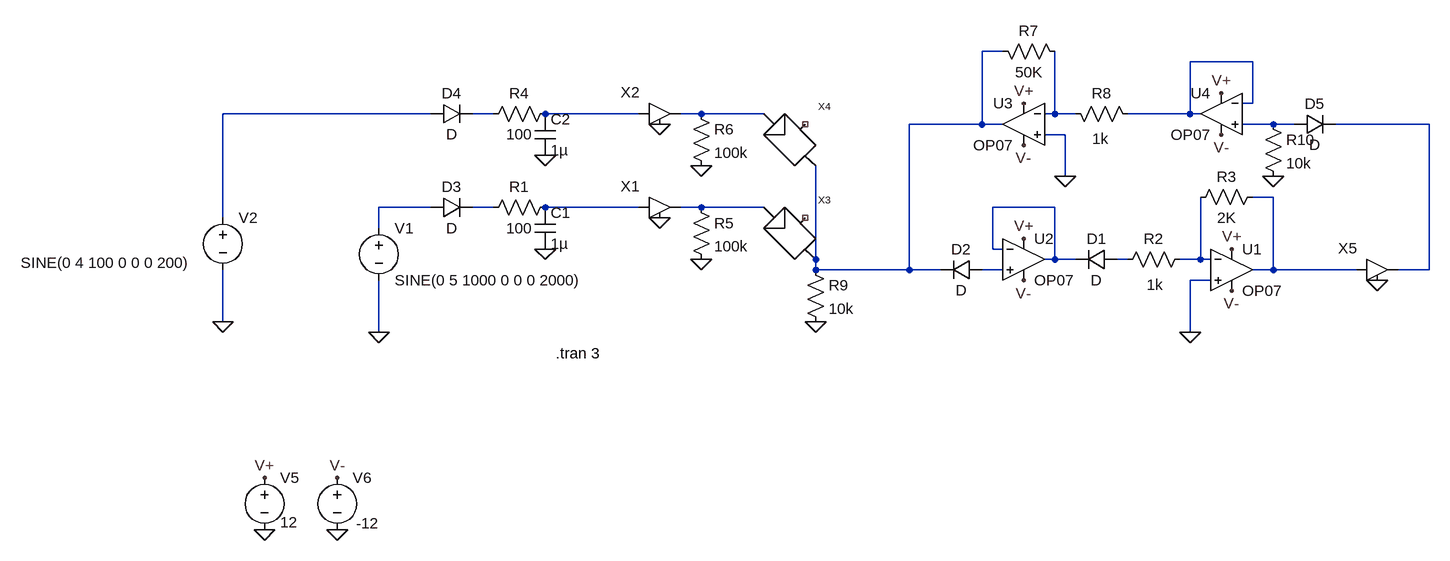
[diagram p0: schematic Net Trial.asc]
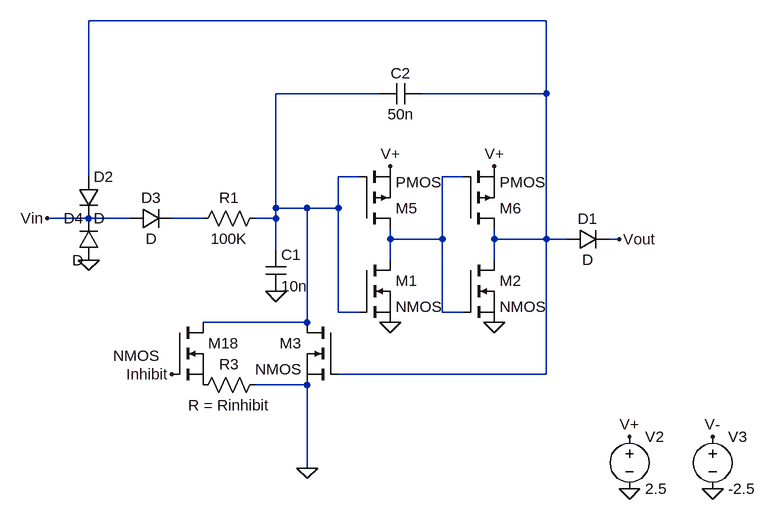
[diagram p1: sub-circuit axon-hillock.asc]
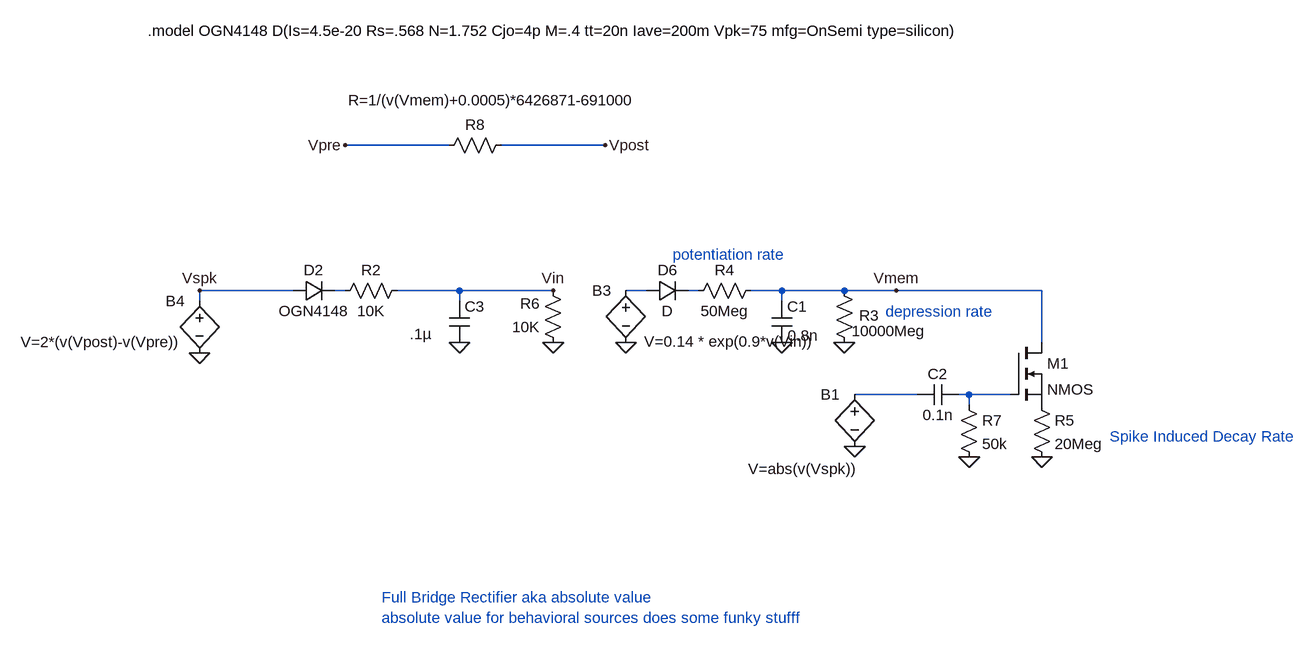
[diagram p2: sub-circuit synapse.asc]
Net Trial.asc, the LTspice schematic file:
Version 4
SHEET 1 1284 804
WIRE 624 -64 592 -64
WIRE 1008 -48 912 -48
WIRE 1008 16 1008 -48
WIRE 1008 16 992 16
WIRE -256 32 -576 32
WIRE -160 32 -192 32
WIRE 64 32 -80 32
WIRE 160 32 128 32
WIRE 256 32 160 32
WIRE 704 32 704 -64
WIRE 704 32 688 32
WIRE 736 32 704 32
WIRE 912 32 912 -48
WIRE 912 32 816 32
WIRE 928 32 912 32
WIRE 592 48 592 -64
WIRE 592 48 480 48
WIRE 624 48 592 48
WIRE 1040 48 992 48
WIRE 1072 48 1040 48
WIRE 1280 48 1136 48
WIRE 720 64 688 64
WIRE 720 128 720 64
WIRE 1040 160 1008 160
WIRE -256 176 -336 176
WIRE -160 176 -192 176
WIRE 64 176 -80 176
WIRE 160 176 128 176
WIRE 256 176 160 176
WIRE 704 176 608 176
WIRE -576 192 -576 32
WIRE -336 208 -336 176
WIRE 608 240 608 176
WIRE 624 240 608 240
WIRE 336 256 336 112
WIRE 704 256 704 176
WIRE 704 256 688 256
WIRE 736 256 704 256
WIRE 816 256 800 256
WIRE 928 256 928 160
WIRE 928 256 896 256
WIRE 944 256 928 256
WIRE 336 272 336 256
WIRE 480 272 480 48
WIRE 480 272 336 272
WIRE 528 272 480 272
WIRE 624 272 592 272
WIRE 1040 272 1040 160
WIRE 1040 272 1008 272
WIRE 1168 272 1040 272
WIRE 1280 272 1280 48
WIRE 1280 272 1232 272
WIRE 944 288 912 288
WIRE -576 352 -576 272
WIRE -336 368 -336 288
WIRE 912 368 912 288
FLAG -336 368 0
FLAG 96 192 0
FLAG -576 352 0
FLAG 1200 288 0
FLAG 96 48 0
FLAG -512 672 0
FLAG -400 672 0
FLAG -512 592 V+
FLAG -400 592 V-
FLAG -80 240 0
FLAG -80 96 0
FLAG 912 368 0
FLAG 976 240 V+
FLAG 976 304 V-
FLAG 160 112 0
FLAG 160 256 0
FLAG 656 224 V+
FLAG 656 288 V-
FLAG 720 128 0
FLAG 656 16 V+
FLAG 656 80 V-
FLAG 960 0 V+
FLAG 960 64 V-
FLAG 1040 128 0
FLAG 336 352 0
SYMBOL voltage -336 192 R0
WINDOW 123 0 0 Left 2
WINDOW 39 0 0 Left 2
SYMATTR InstName V1
SYMATTR Value SINE(0 5 1000 0 0 0 2000)
SYMBOL Axon-Hillock 80 176 R0
SYMATTR InstName X1
SYMATTR SpiceLine Rinhibit = 1Mg
SYMBOL Axon-Hillock 80 32 R0
SYMATTR InstName X2
SYMATTR SpiceLine Rinhibit = 10Meg
SYMBOL voltage -576 176 R0
WINDOW 123 0 0 Left 2
WINDOW 39 0 0 Left 2
WINDOW 3 -311 85 Left 2
SYMATTR Value SINE(0 4 100 0 0 0 200)
SYMATTR InstName V2
SYMBOL Synapse 256 176 R0
SYMATTR InstName X3
SYMBOL Synapse 256 32 R0
SYMATTR InstName X4
SYMBOL voltage -512 576 R0
WINDOW 123 0 0 Left 2
WINDOW 39 0 0 Left 2
WINDOW 3 24 84 Left 2
SYMATTR Value 12
SYMATTR InstName V5
SYMBOL voltage -400 576 R0
WINDOW 123 0 0 Left 2
WINDOW 39 0 0 Left 2
WINDOW 3 29 86 Left 2
SYMATTR Value -12
SYMATTR InstName V6
SYMBOL cap -96 176 R0
SYMATTR InstName C1
SYMATTR Value 1µ
SYMBOL res -64 160 R90
WINDOW 0 0 56 VBottom 2
WINDOW 3 32 56 VTop 2
SYMATTR InstName R1
SYMATTR Value 100
SYMBOL diode -256 192 R270
WINDOW 0 32 32 VTop 2
WINDOW 3 0 32 VBottom 2
SYMATTR InstName D3
SYMBOL cap -96 32 R0
SYMATTR InstName C2
SYMATTR Value 1µ
SYMBOL res -64 16 R90
WINDOW 0 0 56 VBottom 2
WINDOW 3 32 56 VTop 2
SYMATTR InstName R4
SYMATTR Value 100
SYMBOL diode -256 48 R270
WINDOW 0 32 32 VTop 2
WINDOW 3 0 32 VBottom 2
SYMATTR InstName D4
SYMBOL Opamps\\OP07 976 208 R0
SYMATTR InstName U1
SYMBOL res 1024 144 R90
WINDOW 0 0 56 VBottom 2
WINDOW 3 32 56 VTop 2
SYMATTR InstName R3
SYMATTR Value 2K
SYMBOL res 144 160 R0
SYMATTR InstName R5
SYMATTR Value 100k
SYMBOL res 144 16 R0
SYMATTR InstName R6
SYMATTR Value 100k
SYMBOL res 912 240 R90
WINDOW 0 0 56 VBottom 2
WINDOW 3 39 54 VTop 2
SYMATTR InstName R2
SYMATTR Value 1k
SYMBOL Opamps\\OP07 656 192 R0
SYMATTR InstName U2
SYMBOL diode 800 240 R90
WINDOW 0 0 32 VBottom 2
WINDOW 3 32 32 VTop 2
SYMATTR InstName D1
SYMBOL diode 592 256 R90
WINDOW 0 0 32 VBottom 2
WINDOW 3 32 32 VTop 2
SYMATTR InstName D2
SYMBOL Opamps\\OP07 656 -16 M0
SYMATTR InstName U3
SYMBOL res 608 -80 M90
WINDOW 0 0 56 VBottom 2
WINDOW 3 32 56 VTop 2
SYMATTR InstName R7
SYMATTR Value 50K
SYMBOL res 720 16 M90
WINDOW 0 0 56 VBottom 2
WINDOW 3 39 54 VTop 2
SYMATTR InstName R8
SYMATTR Value 1k
SYMBOL diode 1072 64 R270
WINDOW 0 32 32 VTop 2
WINDOW 3 0 32 VBottom 2
SYMATTR InstName D5
SYMBOL Opamps\\OP07 960 -32 M0
SYMATTR InstName U4
SYMBOL Axon-Hillock 1184 272 R0
SYMATTR InstName X5
SYMATTR SpiceLine Rinhibit = 1Mg
SYMBOL res 1024 32 R0
SYMATTR InstName R10
SYMATTR Value 10k
SYMBOL res 320 256 R0
SYMATTR InstName R9
SYMATTR Value 10k
TEXT -64 400 Left 2 !.tran 3

axon-hillock.asc, the sub-circuit schematic file:
Version 4
SHEET 1 1032 680
WIRE 640 -256 -64 -256
WIRE 384 -144 224 -144
WIRE 640 -144 640 -256
WIRE 640 -144 448 -144
WIRE -64 -16 -64 -256
WIRE 352 -16 320 -16
WIRE 512 -16 480 -16
WIRE 224 32 224 -144
WIRE 272 32 224 32
WIRE 320 32 320 -16
WIRE 320 32 272 32
WIRE -64 48 -128 48
WIRE 0 48 -64 48
WIRE 112 48 64 48
WIRE 224 48 224 32
WIRE 224 48 192 48
WIRE 400 80 400 64
WIRE 480 80 480 -16
WIRE 480 80 400 80
WIRE 560 80 560 64
WIRE 640 80 640 -144
WIRE 640 80 560 80
WIRE 672 80 640 80
WIRE 752 80 736 80
WIRE 224 96 224 48
WIRE 400 112 400 80
WIRE 560 112 560 80
WIRE 320 192 320 32
WIRE 352 192 320 192
WIRE 480 192 480 80
WIRE 512 192 480 192
WIRE 272 208 272 32
WIRE 272 208 112 208
WIRE 640 288 640 80
WIRE 640 288 320 288
WIRE 272 304 192 304
WIRE 272 432 272 304
FLAG 768 464 0
FLAG 896 464 0
FLAG 768 384 V+
FLAG 896 384 V-
FLAG 224 160 0
FLAG 400 -32 V+
FLAG 560 -32 V+
FLAG 560 208 0
FLAG 400 208 0
FLAG 272 432 0
FLAG 64 288 Inhibit
FLAG -128 48 Vin
FLAG 752 80 Vout
FLAG -64 112 0
SYMBOL res 208 32 R90
WINDOW 0 0 56 VBottom 2
WINDOW 3 32 56 VTop 2
SYMATTR InstName R1
SYMATTR Value 100K
SYMBOL cap 208 96 R0
SYMATTR InstName C1
SYMATTR Value 10n
SYMBOL cap 448 -160 R90
WINDOW 0 0 32 VBottom 2
WINDOW 3 32 32 VTop 2
SYMATTR InstName C2
SYMATTR Value 50n
SYMBOL voltage 768 368 R0
WINDOW 123 0 0 Left 2
WINDOW 39 0 0 Left 2
SYMATTR InstName V2
SYMATTR Value 2.5
SYMBOL voltage 896 368 R0
WINDOW 123 0 0 Left 2
WINDOW 39 0 0 Left 2
SYMATTR InstName V3
SYMATTR Value -2.5
SYMBOL nmos 320 208 M0
SYMATTR InstName M3
SYMBOL nmos 352 112 R0
SYMATTR InstName M1
SYMBOL nmos 512 112 R0
SYMATTR InstName M2
SYMBOL pmos 352 64 M180
SYMATTR InstName M5
SYMBOL pmos 512 64 M180
SYMATTR InstName M6
SYMBOL nmos 64 208 R0
WINDOW 3 -90 51 Left 2
SYMATTR InstName M18
SYMBOL res 208 288 R90
WINDOW 0 0 56 VBottom 2
WINDOW 3 32 56 VTop 2
SYMATTR InstName R3
SYMATTR Value R = Rinhibit
SYMBOL diode 0 64 R270
WINDOW 0 32 32 VTop 2
WINDOW 3 0 32 VBottom 2
SYMATTR InstName D3
SYMBOL diode 672 96 R270
WINDOW 0 32 32 VTop 2
WINDOW 3 0 32 VBottom 2
SYMATTR InstName D1
SYMBOL diode -80 -16 R0
SYMATTR InstName D2
SYMBOL diode -48 112 R180
WINDOW 0 24 64 Left 2
WINDOW 3 24 0 Left 2
SYMATTR InstName D4

synapse.asc, the sub-circuit schematic file:
Version 4
SHEET 1 2576 1444
WIRE 336 416 176 416
WIRE 576 416 416 416
WIRE 96 640 -48 640
WIRE 176 640 160 640
WIRE 352 640 256 640
WIRE 496 640 352 640
WIRE 640 640 608 640
WIRE 720 640 704 640
WIRE 848 640 800 640
WIRE 944 640 848 640
WIRE 1024 640 944 640
WIRE 1248 640 1024 640
WIRE -48 656 -48 640
WIRE 352 656 352 640
WIRE 848 656 848 640
WIRE 1248 720 1248 640
WIRE 1056 800 960 800
WIRE 1136 800 1120 800
WIRE 1200 800 1136 800
WIRE 1136 816 1136 800
FLAG -48 736 0
FLAG 176 416 Vpre
FLAG 576 416 Vpost
FLAG 352 720 0
FLAG 496 720 0
FLAG 496 640 Vin
FLAG -48 640 Vspk
FLAG 960 880 0
FLAG 944 720 0
FLAG 848 720 0
FLAG 608 720 0
FLAG 1248 896 0
FLAG 1136 896 0
FLAG 1024 640 Vmem
SYMBOL res 512 736 R180
WINDOW 0 36 76 Left 2
WINDOW 3 36 40 Left 2
SYMATTR InstName R6
SYMATTR Value 10K
SYMBOL bv -48 640 R0
WINDOW 0 -52 16 Left 2
WINDOW 3 -275 79 Left 2
SYMATTR InstName B4
SYMATTR Value V=2*(v(Vpost)-v(Vpre))
SYMBOL res 432 400 R90
WINDOW 0 0 56 VBottom 2
WINDOW 3 -69 27 VTop 2
SYMATTR InstName R8
SYMATTR Value R=1/(v(Vmem)+0.0005)*6426871-691000
SYMBOL cap 336 656 R0
WINDOW 3 -61 51 Left 2
SYMATTR Value .1µ
SYMATTR InstName C3
SYMATTR SpiceLine V=16 Irms=7.41 Rser=0.000 Lser=0
SYMBOL diode 96 656 R270
WINDOW 0 32 32 VTop 2
WINDOW 3 0 32 VBottom 2
SYMATTR InstName D2
SYMATTR Value OGN4148
SYMBOL res 272 624 R90
WINDOW 0 0 56 VBottom 2
WINDOW 3 32 56 VTop 2
SYMATTR InstName R2
SYMATTR Value 10K
SYMBOL bv 960 784 R0
WINDOW 0 -52 16 Left 2
WINDOW 3 -164 130 Left 2
SYMATTR InstName B1
SYMATTR Value V=abs(v(Vspk))
SYMBOL cap 832 656 R0
WINDOW 3 25 53 Left 2
SYMATTR Value 0.8n
SYMATTR InstName C1
SYMATTR SpiceLine V=16 Irms=7.41 Rser=0.000 Lser=0
SYMBOL res 960 736 R180
WINDOW 0 -38 58 Left 2
WINDOW 3 -110 34 Left 2
SYMATTR InstName R3
SYMATTR Value 10000Meg
SYMBOL res 816 624 R90
WINDOW 0 0 56 VBottom 2
WINDOW 3 32 56 VTop 2
SYMATTR InstName R4
SYMATTR Value 50Meg
SYMBOL bv 608 624 R0
WINDOW 0 -52 16 Left 2
WINDOW 3 28 94 Left 2
SYMATTR InstName B3
SYMATTR Value V=0.14 * exp(0.9*v(Vin))
SYMBOL nmos 1200 720 R0
SYMATTR InstName M1
SYMBOL res 1232 800 R0
SYMATTR InstName R5
SYMATTR Value 20Meg
SYMBOL cap 1120 784 R90
WINDOW 0 0 32 VBottom 2
WINDOW 3 32 32 VTop 2
SYMATTR InstName C2
SYMATTR Value 0.1n
SYMBOL res 1120 800 R0
SYMATTR InstName R7
SYMATTR Value 50k
SYMBOL diode 640 656 R270
WINDOW 0 32 32 VTop 2
WINDOW 3 0 32 VBottom 2
SYMATTR InstName D6
TEXT -128 240 Left 2 !.model OGN4148 D(Is=4.5e-20 Rs=.568 N=1.752 Cjo=4p M=.4 tt=20n Iave=200m Vpk=75 mfg=OnSemi type=silicon)
TEXT 680 584 Left 2 ;potentiation rate
TEXT 1008 672 Left 2 ;depression rate
TEXT 1352 864 Left 2 ;Spike Induced Decay Rate
TEXT 232 1112 Left 2 ;Full Bridge Rectifier aka absolute value\nabsolute value for behavioral sources does some funky stufff

The netlist it stands for:
* Net Trial.asc
V1 N011 0 SINE(0 5 1000 0 0 0 2000)
XX1 N013 N014 0 axon-hillock params: axon-hillock Rinhibit = 1Mg
XX2 N005 N006 0 axon-hillock params: axon-hillock Rinhibit = 10Meg
V2 N003 0 SINE(0 4 100 0 0 0 200)
XX3 N014 N001 NC_01 synapse
XX4 N006 N001 NC_02 synapse
V5 V+ 0 12
V6 V- 0 -12
C1 N013 0 1µ
R1 N013 N012 100
D3 N011 N012 D
C2 N005 0 1µ
R4 N005 N004 100
D4 N003 N004 D
XU1 0 N017 V+ V- N010 LT1001  ; OP07, pins In+ In- V+ V- OUT
R3 N010 N017 2K
R5 N014 0 100k
R6 N006 0 100k
R2 N017 N016 1k
XU2 N018 N015 V+ V- N015 LT1001  ; OP07, pins In+ In- V+ V- OUT
D1 N016 N015 D
D2 N018 N001 D
XU3 0 N007 V+ V- N001 LT1001  ; OP07, pins In+ In- V+ V- OUT
R7 N001 N007 50K
R8 N007 N002 1k
D5 N008 N009 D
XU4 N008 N002 V+ V- N002 LT1001  ; OP07, pins In+ In- V+ V- OUT
XX5 N010 N009 0 axon-hillock params: axon-hillock Rinhibit = 1Mg
R10 N008 0 10k
R9 N001 0 10k

* block symbol definitions
.subckt axon-hillock Vin Vout Inhibit
R1 N002 N004 100K
C1 N002 0 10n
C2 N001 N002 50n
V2 V+ 0 2.5
V3 V- 0 -2.5
M3 N002 N001 0 0 NMOS
M1 N003 N002 0 0 NMOS
M2 N001 N003 0 0 NMOS
M5 N003 N002 V+ V+ PMOS
M6 N001 N003 V+ V+ PMOS
M18 N002 Inhibit P001 P001 NMOS
R3 0 P001 R = Rinhibit
D3 Vin N004 D
D1 N001 Vout D
D2 N001 Vin D
D4 0 Vin D
.ends axon-hillock

.subckt synapse Vpre Vpost Vmem
R6 0 Vin 10K
B4 Vspk 0 V=2*(v(Vpost)-v(Vpre))
R8 Vpost Vpre R=1/(v(Vmem)+0.0005)*6426871-691000
C3 Vin 0 .1µ V=16 Irms=7.41 Rser=0.000 Lser=0
D2 Vspk N001 OGN4148
R2 Vin N001 10K
B1 N004 0 V=abs(v(Vspk))
C1 Vmem 0 0.8n V=16 Irms=7.41 Rser=0.000 Lser=0
R3 0 Vmem 10000Meg
R4 Vmem N003 50Meg
B3 N002 0 V=0.14 * exp(0.9*v(Vin))
M1 Vmem N005 P001 P001 NMOS
R5 P001 0 20Meg
C2 N005 N004 0.1n
R7 N005 0 50k
D6 N002 N003 D
.model OGN4148 D(Is=4.5e-20 Rs=.568 N=1.752 Cjo=4p M=.4 tt=20n Iave=200m Vpk=75 mfg=OnSemi type=silicon)
* potentiation rate
* depression rate
* Spike Induced Decay Rate
* Full Bridge Rectifier aka absolute value
* absolute value for behavioral sources does some funky stufff
.ends synapse

.model D D
.lib standard.dio
.model NMOS NMOS
.model PMOS PMOS
.lib standard.mos
.tran 3
.lib LTC.lib
.backanno
.end